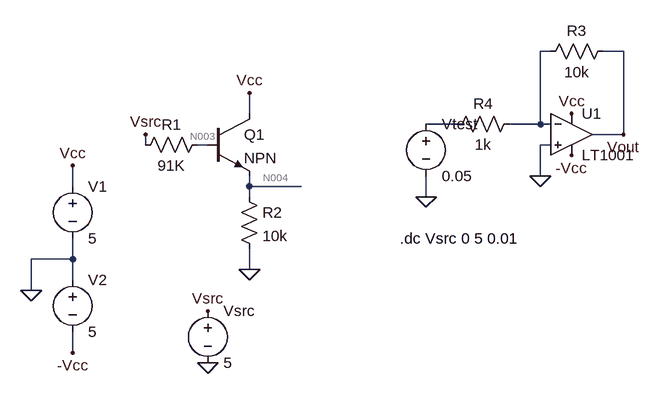
[diagram p0: schematic Circuit_Models.asc]
Circuit_Models.asc, the LTspice schematic file:
Version 4
SHEET 1 880 680
WIRE 624 -32 608 -32
WIRE 736 -32 704 -32
WIRE 160 64 160 32
WIRE 480 80 432 80
WIRE 608 80 608 -32
WIRE 608 80 560 80
WIRE 624 80 608 80
WIRE 736 96 736 -32
WIRE 736 96 688 96
WIRE 0 112 0 96
WIRE 96 112 80 112
WIRE 624 112 608 112
WIRE 608 160 608 112
WIRE -112 176 -112 144
WIRE 160 176 160 160
WIRE 240 176 160 176
WIRE 160 192 160 176
WIRE 432 192 432 160
WIRE -112 288 -112 256
WIRE -112 288 -176 288
WIRE 160 304 160 272
WIRE -112 320 -112 288
WIRE -176 336 -176 288
WIRE -112 432 -112 400
FLAG -112 144 Vcc
FLAG 160 32 Vcc
FLAG 160 304 0
FLAG -176 336 0
FLAG -112 432 -Vcc
FLAG 656 64 Vcc
FLAG 656 128 -Vcc
FLAG 608 160 0
FLAG 736 96 Vout
FLAG 432 192 0
FLAG 96 368 Vsrc
FLAG 96 448 0
FLAG 0 96 Vsrc
SYMBOL npn 96 64 R0
SYMATTR InstName Q1
SYMBOL voltage -112 160 R0
WINDOW 123 0 0 Left 0
WINDOW 39 0 0 Left 0
SYMATTR InstName V1
SYMATTR Value 5
SYMBOL res -16 128 R270
WINDOW 0 32 56 VTop 2
WINDOW 3 0 56 VBottom 2
SYMATTR InstName R1
SYMATTR Value 91K
SYMBOL res 144 176 R0
SYMATTR InstName R2
SYMATTR Value 10k
SYMBOL OpAmps\\LT1001 656 32 R0
SYMATTR InstName U1
SYMBOL voltage -112 304 R0
WINDOW 123 0 0 Left 0
WINDOW 39 0 0 Left 0
SYMATTR InstName V2
SYMATTR Value 5
SYMBOL res 720 -48 R90
WINDOW 0 0 56 VBottom 2
WINDOW 3 32 56 VTop 2
SYMATTR InstName R3
SYMATTR Value 10k
SYMBOL res 576 64 R90
WINDOW 0 0 56 VBottom 2
WINDOW 3 32 56 VTop 2
SYMATTR InstName R4
SYMATTR Value 1k
SYMBOL voltage 432 64 R0
WINDOW 123 0 0 Left 0
WINDOW 39 0 0 Left 0
SYMATTR InstName Vtest
SYMATTR Value 0.05
SYMBOL voltage 96 352 R0
WINDOW 123 0 0 Left 0
WINDOW 39 0 0 Left 0
SYMATTR InstName Vsrc
SYMATTR Value 5
TEXT 392 256 Left 2 !.dc Vsrc 0 5 0.01

The netlist it stands for:
* Circuit_Models.asc
Q1 Vcc N003 N004 0 NPN
V1 Vcc 0 5
R1 Vsrc N003 91K
R2 N004 0 10k
XU1 0 N001 Vcc -Vcc Vout LT1001  ; pins In+ In- V+ V- OUT
V2 0 -Vcc 5
R3 Vout N001 10k
R4 N001 N002 1k
Vtest N002 0 0.05
Vsrc Vsrc 0 5
.model NPN NPN
.model PNP PNP
.lib standard.bjt
.dc Vsrc 0 5 0.01
.lib LTC.lib
.backanno
.end

* Results of the author's LTspice run, read from the files saved beside the schematic
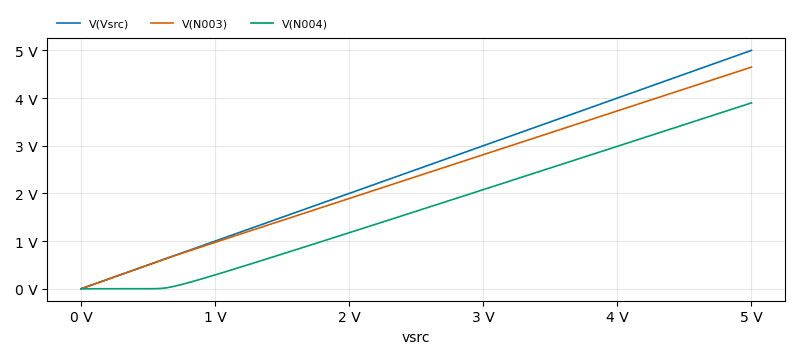
[diagram p1: DC transfer characteristic of Circuit_Models.asc, plotted from the saved traces]
* DC transfer characteristic, 1 run:
*   V(Vsrc): 0 V at vsrc=0 V, 5 V at vsrc=5 V, min 0 V, max 5 V
*   V(N003): 455 nV at vsrc=0 V, 4.649 V at vsrc=5 V, min 455 nV, max 4.649 V
*   V(N004): 1.005 pV at vsrc=0 V, 3.899 V at vsrc=5 V, min 1.005 pV, max 3.899 V